# EasyEDA schematic FT757GX light bar_RH.json
TITLE: Sheet_1; REV: 1.0; Date: 2024-12-10; Sheet: 1/1; Company: Your Company
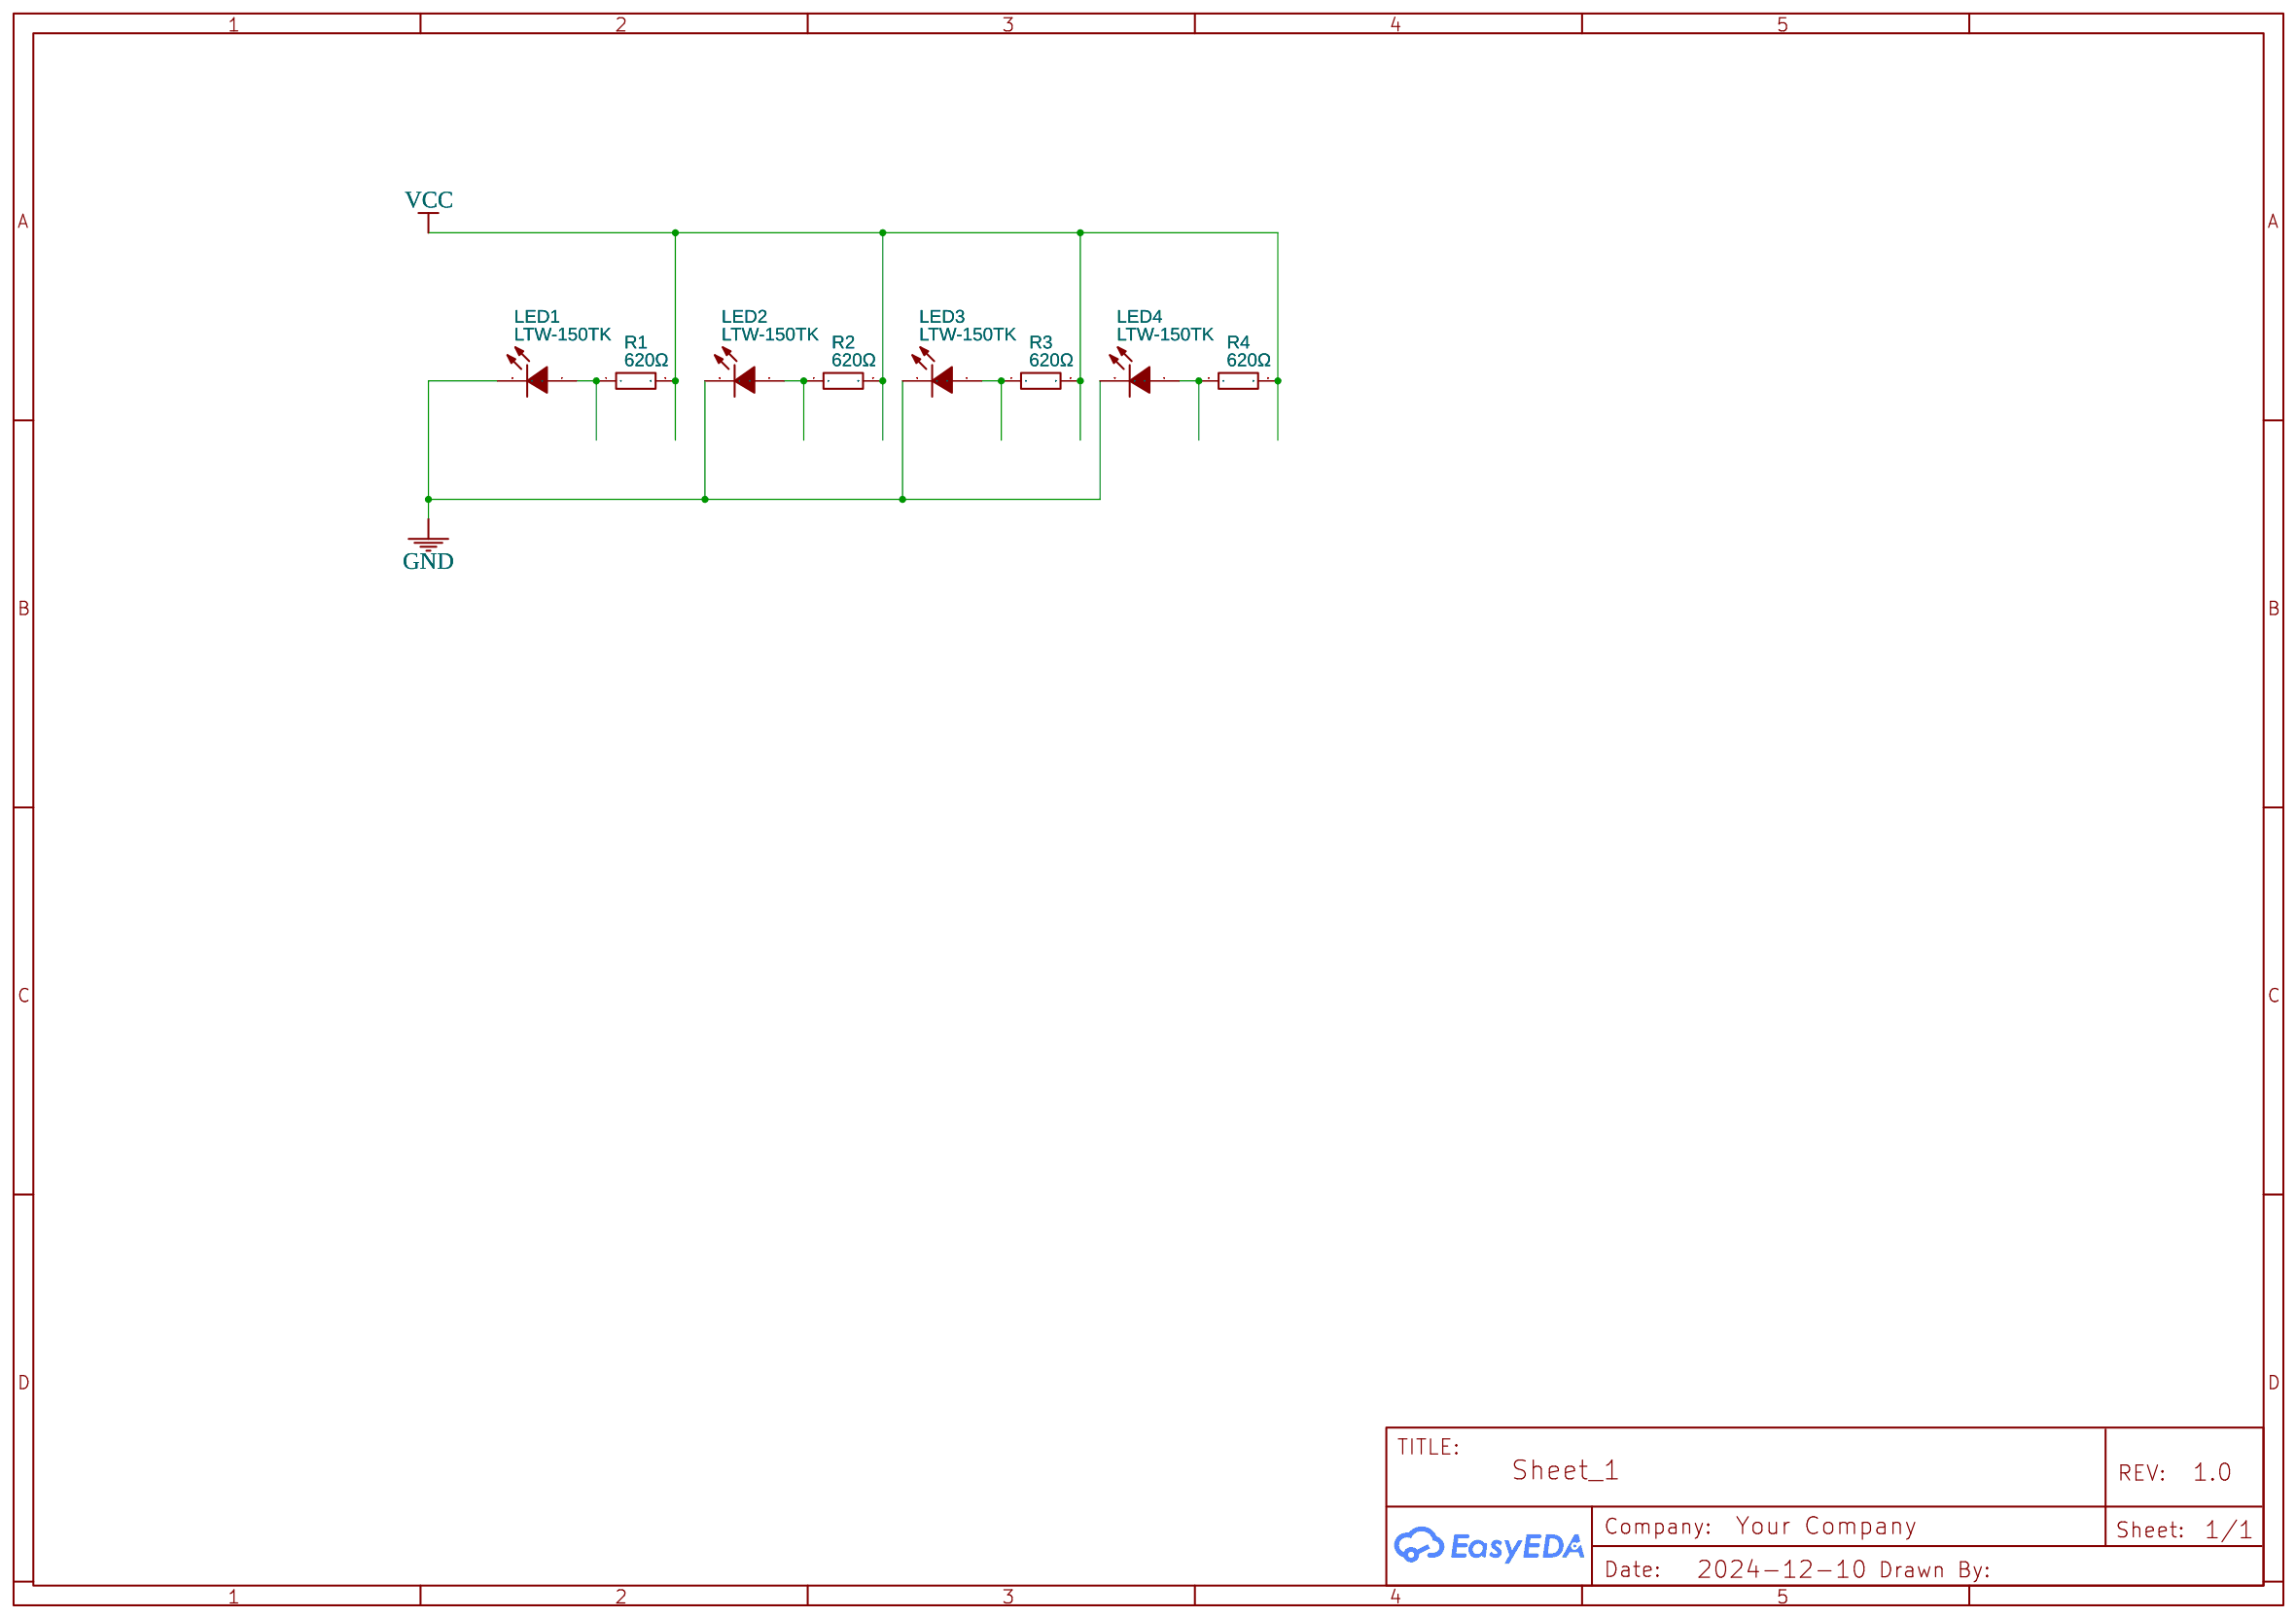
[diagram p0: schematic sheet]

## Parts
LED1  LTW-150TK  [LED1206-R-RD_WHITE]
LED2  LTW-150TK  [LED1206-R-RD_WHITE]
LED3  LTW-150TK  [LED1206-R-RD_WHITE]
LED4  LTW-150TK  [LED1206-R-RD_WHITE]
R1  620Ω  [R1206]
R2  620Ω  [R1206]
R3  620Ω  [R1206]
R4  620Ω  [R1206]

## Library data of the parts
LED1-LED4 = LTW-150TK: Contributor: LCSC; Supplier: LCSC; Supplier Part: C133134; Manufacturer: LITEON(光宝); JLCPCB Part Class: Extended Part
R1-R4 = AECR1206F620RK9: Contributor: LCSC; Supplier: LCSC; Supplier Part: C352049; Manufacturer: RESI(开步睿思); JLCPCB Part Class: Extended Part

## Nets
GND: LED1.2(K) LED2.2(K) LED3.2(K) LED4.2(K)
VCC: R1.2 R2.2 R3.2 R4.2
Net-(LED1-1): LED1.1(A) R1.1
Net-(LED2-1): LED2.1(A) R2.1
Net-(LED3-1): LED3.1(A) R3.1
Net-(LED4-1): LED4.1(A) R4.1
